# Altium project Headstage_Mainboard.PrjPcb
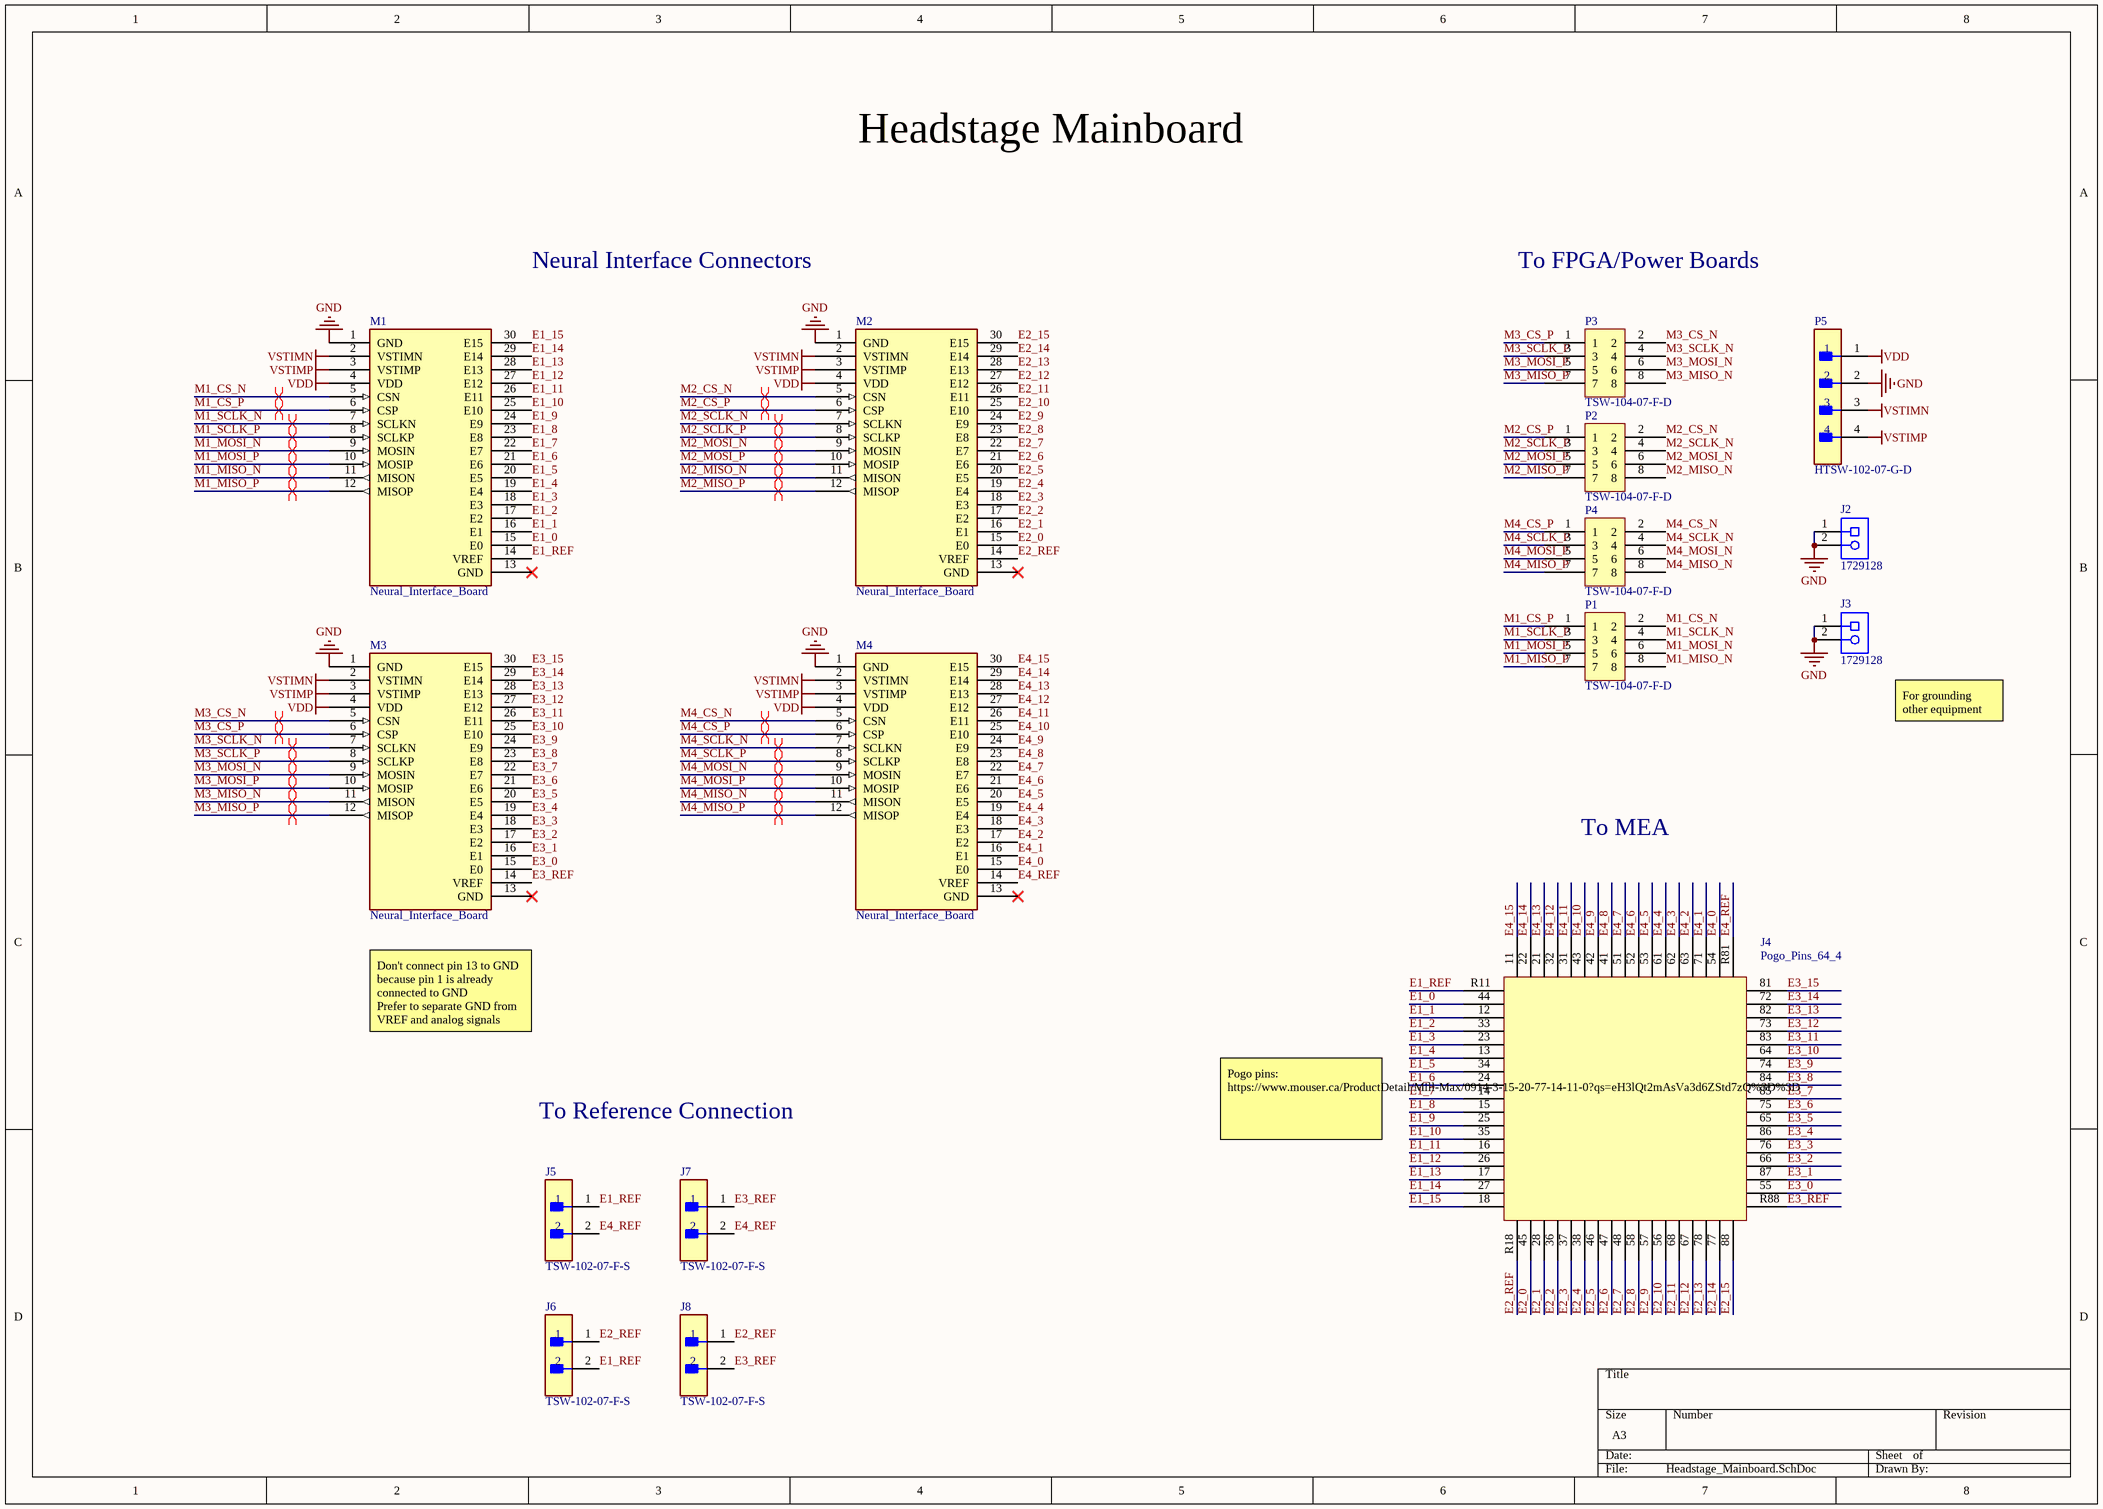
[diagram p0: Headstage_Mainboard.SchDoc]
1 sheet, 16 parts. Net scope: hierarchical (ports join the sheet entries above them; power ports are global).
Board file: Headstage_Mainboard.PcbDoc

## Sheet Headstage_Mainboard.SchDoc
size A3; DocumentNumber: 1; SheetNumber: 1; SheetTotal: 1

### Parts
J2  1729128  [PHOE-1729128-2_V]
J3  1729128  [PHOE-1729128-2_V]
J4  Pogo_Pins_64_4  [Pogo_Pins_64_4]
J5  TSW-102-07-F-S  [FP-TSW-102-07-F-S-MFG]
J6  TSW-102-07-F-S  [FP-TSW-102-07-F-S-MFG]
J7  TSW-102-07-F-S  [FP-TSW-102-07-F-S-MFG]
J8  TSW-102-07-F-S  [FP-TSW-102-07-F-S-MFG]
M1  Neural_Interface_Board  [Neural_Interface_Board]  (no BOM)
M2  Neural_Interface_Board  [Neural_Interface_Board]  (no BOM)
M3  Neural_Interface_Board  [Neural_Interface_Board]  (no BOM)
M4  Neural_Interface_Board  [Neural_Interface_Board]  (no BOM)
P1  TSW-104-07-F-D  [SAMTEC_TSW-104-07-F-D]
P2  TSW-104-07-F-D  [SAMTEC_TSW-104-07-F-D]
P3  TSW-104-07-F-D  [SAMTEC_TSW-104-07-F-D]
P4  TSW-104-07-F-D  [SAMTEC_TSW-104-07-F-D]
P5  HTSW-102-07-G-D  [FP-HTSW-102-07-G-D-MFG]

### Nets
GND: J2.1 J2.2 J3.1 J3.2 M1.1(GND) M2.1(GND) M3.1(GND) M4.1(GND) P5.2
VDD: M1.4(VDD) M2.4(VDD) M3.4(VDD) M4.4(VDD) P5.1
VSTIMN: M1.2(VSTIMN) M2.2(VSTIMN) M3.2(VSTIMN) M4.2(VSTIMN) P5.3
VSTIMP: M1.3(VSTIMP) M2.3(VSTIMP) M3.3(VSTIMP) M4.3(VSTIMP) P5.4
E1_0: J4.44 M1.15(E0)
E1_1: J4.12 M1.16(E1)
E1_2: J4.33 M1.17(E2)
E1_3: J4.23 M1.18(E3)
E1_4: J4.13 M1.19(E4)
E1_5: J4.34 M1.20(E5)
E1_6: J4.24 M1.21(E6)
E1_7: J4.14 M1.22(E7)
E1_8: J4.15 M1.23(E8)
E1_9: J4.25 M1.24(E9)
E1_10: J4.35 M1.25(E10)
E1_11: J4.16 M1.26(E11)
E1_12: J4.26 M1.27(E12)
E1_13: J4.17 M1.28(E13)
E1_14: J4.27 M1.29(E14)
E1_15: J4.18 M1.30(E15)
E1_REF: J4.R11 J5.1 J6.2 M1.14(VREF)
E2_0: J4.45 M2.15(E0)
E2_1: J4.28 M2.16(E1)
E2_2: J4.36 M2.17(E2)
E2_3: J4.37 M2.18(E3)
E2_4: J4.38 M2.19(E4)
E2_5: J4.46 M2.20(E5)
E2_6: J4.47 M2.21(E6)
E2_7: J4.48 M2.22(E7)
E2_8: J4.58 M2.23(E8)
E2_9: J4.57 M2.24(E9)
E2_10: J4.56 M2.25(E10)
E2_11: J4.68 M2.26(E11)
E2_12: J4.67 M2.27(E12)
E2_13: J4.78 M2.28(E13)
E2_14: J4.77 M2.29(E14)
E2_15: J4.88 M2.30(E15)
E2_REF: J4.R18 J6.1 J8.1 M2.14(VREF)
E3_0: J4.55 M3.15(E0)
E3_1: J4.87 M3.16(E1)
E3_2: J4.66 M3.17(E2)
E3_3: J4.76 M3.18(E3)
E3_4: J4.86 M3.19(E4)
E3_5: J4.65 M3.20(E5)
E3_6: J4.75 M3.21(E6)
E3_7: J4.85 M3.22(E7)
E3_8: J4.84 M3.23(E8)
E3_9: J4.74 M3.24(E9)
E3_10: J4.64 M3.25(E10)
E3_11: J4.83 M3.26(E11)
E3_12: J4.73 M3.27(E12)
E3_13: J4.82 M3.28(E13)
E3_14: J4.72 M3.29(E14)
E3_15: J4.81 M3.30(E15)
E3_REF: J4.R88 J7.1 J8.2 M3.14(VREF)
E4_0: J4.54 M4.15(E0)
E4_1: J4.71 M4.16(E1)
E4_2: J4.63 M4.17(E2)
E4_3: J4.62 M4.18(E3)
E4_4: J4.61 M4.19(E4)
E4_5: J4.53 M4.20(E5)
E4_6: J4.52 M4.21(E6)
E4_7: J4.51 M4.22(E7)
E4_8: J4.41 M4.23(E8)
E4_9: J4.42 M4.24(E9)
E4_10: J4.43 M4.25(E10)
E4_11: J4.31 M4.26(E11)
E4_12: J4.32 M4.27(E12)
E4_13: J4.21 M4.28(E13)
E4_14: J4.22 M4.29(E14)
E4_15: J4.11 M4.30(E15)
E4_REF: J4.R81 J5.2 J7.2 M4.14(VREF)
M1_CS_N: M1.5(CSN) P1.2
M1_CS_P: M1.6(CSP) P1.1
M1_MISO_N: M1.11(MISON) P1.8
M1_MISO_P: M1.12(MISOP) P1.7
M1_MOSI_N: M1.9(MOSIN) P1.6
M1_MOSI_P: M1.10(MOSIP) P1.5
M1_SCLK_N: M1.7(SCLKN) P1.4
M1_SCLK_P: M1.8(SCLKP) P1.3
M2_CS_N: M2.5(CSN) P2.2
M2_CS_P: M2.6(CSP) P2.1
M2_MISO_N: M2.11(MISON) P2.8
M2_MISO_P: M2.12(MISOP) P2.7
M2_MOSI_N: M2.9(MOSIN) P2.6
M2_MOSI_P: M2.10(MOSIP) P2.5
M2_SCLK_N: M2.7(SCLKN) P2.4
M2_SCLK_P: M2.8(SCLKP) P2.3
M3_CS_N: M3.5(CSN) P3.2
M3_CS_P: M3.6(CSP) P3.1
M3_MISO_N: M3.11(MISON) P3.8
M3_MISO_P: M3.12(MISOP) P3.7
M3_MOSI_N: M3.9(MOSIN) P3.6
M3_MOSI_P: M3.10(MOSIP) P3.5
M3_SCLK_N: M3.7(SCLKN) P3.4
M3_SCLK_P: M3.8(SCLKP) P3.3
M4_CS_N: M4.5(CSN) P4.2
M4_CS_P: M4.6(CSP) P4.1
M4_MISO_N: M4.11(MISON) P4.8
M4_MISO_P: M4.12(MISOP) P4.7
M4_MOSI_N: M4.9(MOSIN) P4.6
M4_MOSI_P: M4.10(MOSIP) P4.5
M4_SCLK_N: M4.7(SCLKN) P4.4
M4_SCLK_P: M4.8(SCLKP) P4.3

Not connected (* = marked no-connect by the designer): M1 13(GND)*; M2 13(GND)*; M3 13(GND)*; M4 13(GND)*

### Layout directives
differential pair: M1_CS_N, M1_CS_P, M1_MISO_N, M1_MISO_P, M1_MOSI_N, M1_MOSI_P, M1_SCLK_N, M1_SCLK_P, M2_CS_N, M2_CS_P, M2_MISO_N, M2_MISO_P, M2_MOSI_N, M2_MOSI_P, M2_SCLK_N, M2_SCLK_P, M3_CS_N, M3_CS_P, M3_MISO_N, M3_MISO_P, M3_MOSI_N, M3_MOSI_P, M3_SCLK_N, M3_SCLK_P, M4_CS_N, M4_CS_P, M4_MISO_N, M4_MISO_P, M4_MOSI_N, M4_MOSI_P, M4_SCLK_N, M4_SCLK_P

### Notes on the sheet
- Headstage Mainboard
- Neural Interface Connectors
- To FPGA/Power Boards
- For grounding other equipment
- To MEA
- Don't connect pin 13 to GND because pin 1 is already connected to GND
  Prefer to separate GND from VREF and analog signals
- To Reference Connection
- Pogo pins:
  https://www.mouser.ca/ProductDetail/Mill-Max/0914-3-15-20-77-14-11-0?qs=eH3lQt2mAsVa3d6ZStd7zQ%3D%3D

### Library data of the parts
J2 J3 = CMP-2000-05815-1: PCB Terminal Block, 13.5 A, 400 V, 2-Pin THD, RoHS, Bulk; Manufacturer: Phoenix Contact; Package Version: 03/2015; No. of Rows: 1; Pitch: 5.08mm; No. of Positions: 2; Voltage Rating: 400V; Current Rating: 13500mA; Manufacturer URL: http://www.phoenixcontact.com/; Datasheet URL: https://datasheet.ciiva.com/16046/1729128-16046181.pdf; RoHS: TRUE; Package URL: https://www.phoenixcontact.com/online/portal/pi/pxc/product_detail_page/!ut/p/b1/3VdJjqNKFDxLH8AFycySyWY2ozFsEPOMMQaDOX1XedGL_1Vdm5YXJleknhSKeBkvI6EA8ncAo3AYoDhBQGco6KN7VURTdemj9us_IEKEZo_YHiPAEWEFmDGOHMORkqKYCORBZxgL7ZoaZYcbFFUZ3fqxSY6GOuxydWUuHqz1ynmMFygu583Bob0Ewr6Sd_l-5m-kAueHiB0jpRwZwe58wwtkpxtMYd_LmGcDRU02dRNEyWt6Y2ti5pSyJ_reIkzIulrqApdnbT11V5jnCKbYNCvhEM1MCpPByat_X379-iThf08CI5GfOPqfBeS3BRoBOdD55AKVv0iLwCMq-2BrzXWSGRH7pUGD9uwXQjiph3xL0DKQwdGa0JImiIOmBNOestqgwTHSSs2oOep-78apyXQBvNi8ZLaFjvjWvcaUEBu0MC6Wbe-d6mB0FAebo2lUWinqYaZs5DAYzV0RP9yitUjnGJ0iI9xhZkT42OCQNUJJhkgWINNQLP2JFP6OpMg3JCVg70jqHT0lvKOnhHf0lPuOnnLf0VPuWx6_dxwUIvwk5WMkT0kLL1mh61l2yZVSzG3pYV_bqo-mj6uMKwKwdnnW8Jh5RTOJzMOA5c-eJDaZQw4mTMPH02PvS_ZAqNVjVTo2WyYLkwH_KU1mmmG5kjRhDqPXLwwVHvVOjCM60-fpXvTDfMGW1PVFVS1r4e4yVDk4ZdNbkUHvqPqQSeian4UD39fNKmachqdJ1NJbyk8rXT9mXTvPk3oE5meulKGgiruPJek-4I9hTT6G8ZLOyRSm2RRVbThERQad5OS28hdt4YW4vG0stgYYzsWsK4_7y6DZMjJSCqri1kyiZR5vD7pwIrNR7QwPHTcLTI5qT7eRlpHrdGiupYlqQDJ7zy_CND8fWWBoLRXxk1RVcXiBQwbTD4Xi7KL-FuO94t9xaqweXzH; PartNumber: 1729128; Package Description: 2-Pin Through Hole Device, Body 8.1 x 10.16 mm, Pitch 5.08 mm; Datasheet Version: 12/2013; Mounting Technology: ThroughHole; Orientation: Horizontal; Package Reference: 1729128-2; Packing: Bulk
J4 = Pogo_Pins_64_4: Pogo pins, 64 recording electrodes, 4 reference electrodes
J5-J8 = CMP-02766-001458-1: CONN HEADER VERT 2POS 2.54MM; Gender: Male; Max Current Rating: 7.6A; Number of Contacts: 2; Max Voltage Rating (AC): 550V; Orientation: Straight; Depth: 2.54mm; Series: TSW; Package Quantity: 1; Min Operating Temperature: -55°C; Max Operating Temperature: 125°C; Contact Type: Male Pin; Contact Shape: Square; Color: Black; Housing Color: Black; Connector Type: Header; Fastening Type: Pull; Radiation Hardening: No; Pitch: 2.54mm; Housing Material: Polyester; Mount: Through Hole; Number of Positions: 2; Number of Rows: 1; Contact Material: Bronze; Insulation Color: Black; Contact Finish - Mating: GOLD; Termination: Solder; Insulation Material: PBT; Length: 5.08mm; Flammability Rating: UL94 V-0; Contact Mating Length: 0.23inch; REACH SVHC: No SVHC; Contact Plating: Gold; RoHS Compliant: Yes; Packaging: Bulk
P1-P4 = TSW-104-07-F-D: Board Connector, 8 Contact(s), 2 Row(s), Male, Straight, 0.1 inch Pitch, Solder Terminal, Black Insulator; Manufacturer: Samtec; Option: General Purpose; Additional Feature: E.L.P.; Filter Feature: No; Mating Information: MULTIPLE MATING PARTS AVAILABLE; Number of Rows Loaded: 2; Number of Contacts: 8; Body/Shell Style: RECEPTACLE; Contact Pattern: RECTANGULAR; Contact Style: SQ PIN-SKT; Number Of Connectors: 1; PCB Contact Row Spacing: 5.08mm; Reference Standard: UL; Reliability: COMMERCIAL; Supplier: Arrow Electronics; Supplier Part Number: TSW-104-07-F-D; Manufacturer Part Number: TSW-104-07-F-D; RoHS: Yes; Category: Connectors; Stock: 1; Pricing: 1=0.9123, 50=0.706, 100=0.5756 (USD); Mounting Technology: Board; Contact Material: Bronze; Contact Finish - Mating: GOLD FLASH OVER NICKEL (50); Contact Finish - Termination: Matte Tin (Sn) - with Nickel (Ni) barrier; Insulation Color: Black; Insulation Material: Glass; Connector Type: BOARD CONNECTOR; JESD-609 Code: e3; Contact Gender: Male; Mixed Contacts: No; Mounting Style: STRAIGHT; Termination: Solder; Number Of PCB Rows: 2; PCB Contact Pattern: RECTANGULAR; Terminal Pitch: 2.54mm; Body Breadth: 0.1inch; Body Depth: 0.1inch; Mating Contact Pitch: 0.1inch; Mating Contact Row Spacing: 0.1inch; Terminal Length: 0.1inch; Flammability Rating: UL94 V-0; DIN Conformance: No; IEC Conformance: No; MIL Conformance: No; Reach SVHC Compliant: Yes; RoHS Compliant: Yes; ComponentLink1URL: https://datasheet.ciiva.com:443/pdfs/VipMasterIC/IC/SAMI/SAMI-S-A0003531373/SAMI-S-A0003531373-1.pdf?src-supplier=IHS+Markit; ComponentLink1Description: https://datasheet.ciiva.com:443/pdfs/VipMasterIC/IC/SAMI/SAMI-S-A0003531373/SAMI-S-A0003531373-1.pdf?src-supplier=IHS+Markit; ComponentLink2URL: https://datasheet.ciiva.com/739/tsw-xxx-xx-xxx-x-xx-xxx-mkt-739906.pdf?src-supplier=Digi-Key; ComponentLink2Description: https://datasheet.ciiva.com/739/tsw-xxx-xx-xxx-x-xx-xxx-mkt-739906.pdf?src-supplier=Digi-Key
P5 = CMP-02766-000010-1: CONN HEADER VERT 4POS 2.54MM; Manufacturer: Samtec; Voltage Rating: 550V; Conn Orientation: Straight; Number Of Contacts: 4; Conn Gender: Male; Current Rating: 6.3A; Number Of Rows: 2; Category: Conn; Temperature: -55°C to +125°C; Automotive: No; Digikey Description: CONN HEADER VERT 4POS 2.54MM; ComponentLink2URL: http://suddendocs.samtec.com/catalog_english/htsw_th.pdf; Device Class L2: Headers and Wire Housings; Mouser Description: Conn Unshrouded Header HDR 4 POS 2.54mm Solder ST Thru-Hole Bag; Manufacturer Part Number: HTSW-102-07-G-D; Temperature Range High: +125°C; Contact Material: Gold,Nickel; Temperature Range Low: -55°C; ComponentLink2Description: Datasheet; Device Class L1: Connectors; Pitch: 2.54mm; Octopart: https://octopart.com/htsw-102-07-g-d-samtec-10531767; RoHS: TRUE; Package: HTSW-102-07-G-D; Lead Free: Yes; Device Class L3: unset; Height: 8.71mm